# EAGLE schematic Quadrupedv2.0 (EAGLE 9.6.2)

## Sheet 1 of 2: Page 1
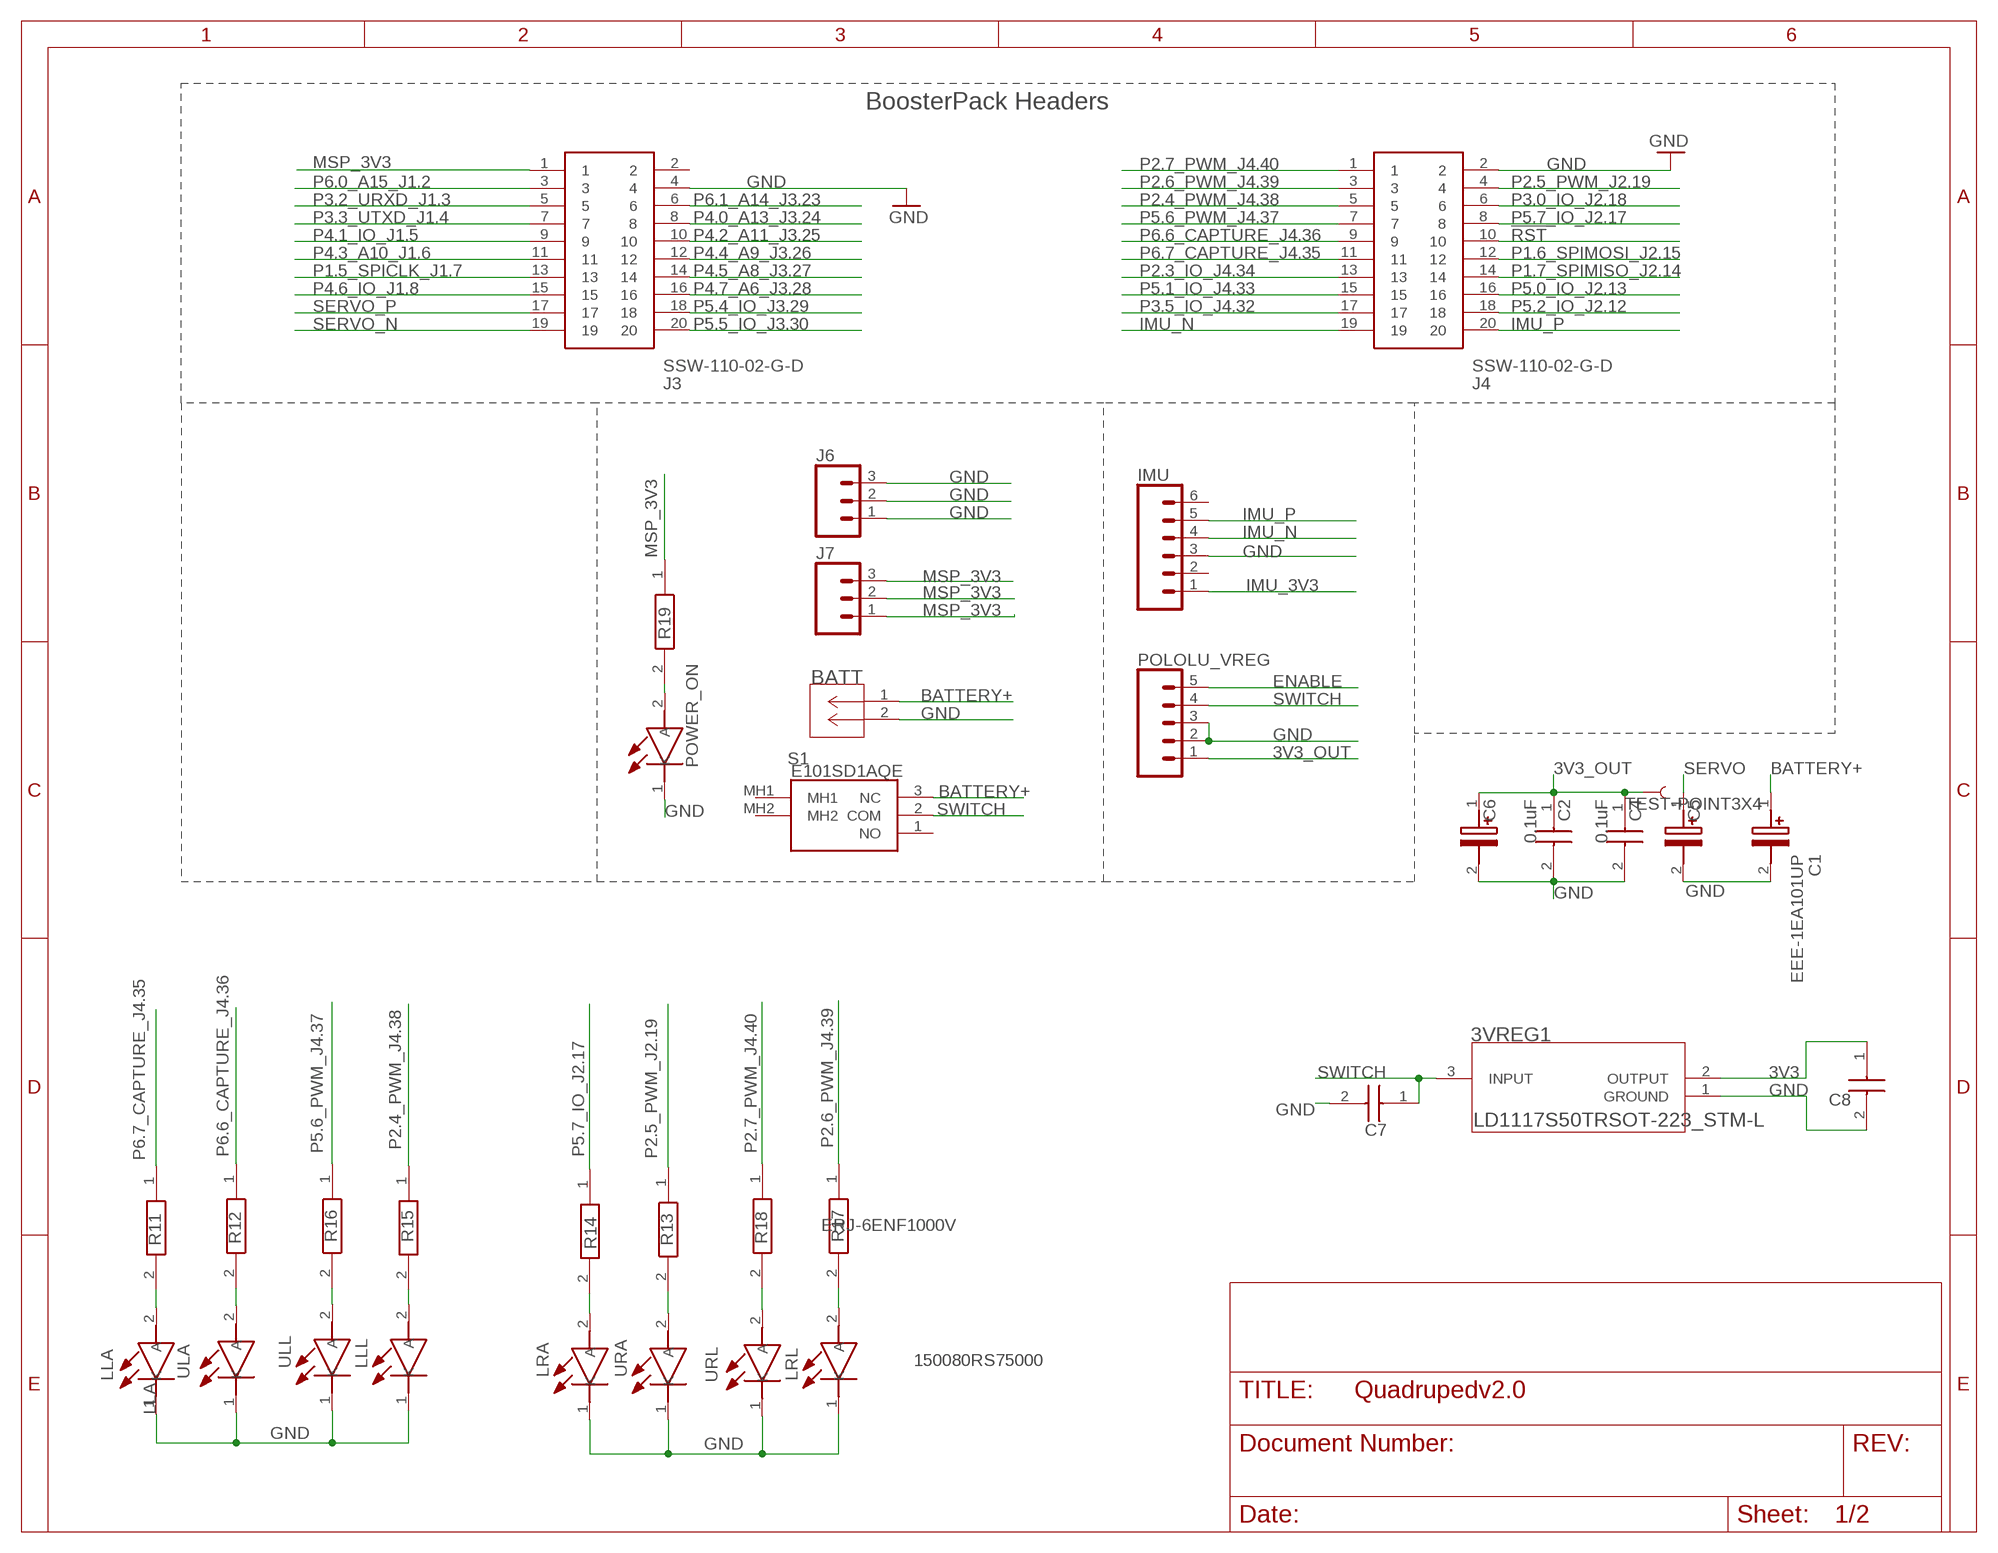
[diagram p0: schematic, sheet 1]

### Parts
3VREG1  LD1117S50TRSOT-223_STM-L  [SOT-223_STM-L]
BATT  640456-2  [CONN2_640456-2_TEC]
C1  EEE-1EA101UP  [CAPAE830X650N]
C2  0.1uF  C0805C104K5RAC7411  [CAPC2012X88N]
C4  0.1uF  C0805C104K5RAC7411  [CAPC2012X88N]
C5  EEE-1EA101UP  [CAPAE830X650N]
C6  EEE-1EA101UP  [CAPAE830X650N]
C7  C0805C104K5RAC7411  [CAPC2012X88N]
C8  C0805C104K5RAC7411  [CAPC2012X88N]
IMU  CONN_06SILK_FEMALE_PTH  [1X06]
J3  SSW-110-02-G-D  [SAMTEC_SSW-110-02-G]
J4  SSW-110-02-G-D  [SAMTEC_SSW-110-02-G]
J6  CONN_03CONN_3F  [1X03_FEMALE]
J7  CONN_03CONN_3F  [1X03_FEMALE]
LLA  150080RS75000  [LEDC2012X80N]
LLL  150080RS75000  [LEDC2012X80N]
LRA  150080RS75000  [LEDC2012X80N]
LRL  150080RS75000  [LEDC2012X80N]
POLOLU_VREG  CONN_05  [1X05]
POWER_ON  150080RS75000  [LEDC2012X80N]
R11  ERJ-6ENF1000V  [RESC2012X70N]
R12  ERJ-6ENF1000V  [RESC2012X70N]
R13  ERJ-6ENF1000V  [RESC2012X70N]
R14  ERJ-6ENF1000V  [RESC2012X70N]
R15  ERJ-6ENF1000V  [RESC2012X70N]
R16  ERJ-6ENF1000V  [RESC2012X70N]
R17  ERJ-6ENF1000V  [RESC2012X70N]
R18  ERJ-6ENF1000V  [RESC2012X70N]
R19  ERJ-6ENF1000V  [RESC2012X70N]
S1  E101SD1AQE  [E101SD1AQE]
TP22  TEST-POINT3X4  [PAD.03X.04]
ULA  150080RS75000  [LEDC2012X80N]
ULL  150080RS75000  [LEDC2012X80N]
URA  150080RS75000  [LEDC2012X80N]
URL  150080RS75000  [LEDC2012X80N]

### Nets
3V3 [LOWCurrent]: 3VREG1.2(OUTPUT) C8.1 ; also sheet 2
3V3_OUT: C2.1 C4.1 C6.1(+) POLOLU_VREG.1 TP22.P$1 ; also sheet 2
!RST: J4.10
BATTERY+: BATT.1 C1.1(+) S1.3(NC)
ENABLE: POLOLU_VREG.5
GND: 3VREG1.1(GROUND) BATT.2 C1.2(-) C2.2 C4.2 C5.2(-) C6.2(-) C7.2 C8.2 IMU.3 J3.4 J4.2 J6.1 J6.2 J6.3 LLA.1(K) LLL.1(K) LRA.1(K) LRL.1(K) POLOLU_VREG.2 POLOLU_VREG.3 POWER_ON.1(K) ULA.1(K) ULL.1(K) URA.1(K) URL.1(K) ; also sheet 2
IMU_3V3 [LOWCurrent]: IMU.1 ; also sheet 2
IMU_N [DIFF_I2C2]: IMU.4 J4.19
IMU_P [DIFF_I2C2]: IMU.5 J4.20
MSP_3V3 [LOWCurrent]: J3.1 J7.1 J7.2 J7.3 R19.1 ; also sheet 2
N$2: R12.2 ULA.2(A)
N$7: LLA.2(A) R11.2
N$8: R16.2 ULL.2(A)
N$11: LLL.2(A) R15.2
N$12: R13.2 URA.2(A)
N$13: LRA.2(A) R14.2
N$14: R18.2 URL.2(A)
N$15: LRL.2(A) R17.2
N$19: POWER_ON.2(A) R19.2
P1.5_SPICLK_J1.7: J3.13
P1.6_SPIMOSI_J2.15: J4.12
P1.7_SPIMISO_J2.14: J4.14
P2.3_IO_J4.34: J4.13
P2.4_PWM_J4.38: J4.5 R15.1
P2.5_PWM_J2.19: J4.4 R13.1
P2.6_PWM_J4.39: J4.3 R17.1
P2.7_PWM_J4.40: J4.1 R18.1
P3.0_IO_J2.18: J4.6
P3.2_URXD_J1.3: J3.5
P3.3_UTXD_J1.4: J3.7
P3.5_IO_J4.32: J4.17
P4.0_A13_J3.24: J3.8
P4.1_IO_J1.5: J3.9
P4.2_A11_J3.25: J3.10
P4.3_A10_J1.6: J3.11
P4.4_A9_J3.26: J3.12
P4.5_A8_J3.27: J3.14
P4.6_IO_J1.8: J3.15
P4.7_A6_J3.28: J3.16
P5.0_IO_J2.13: J4.16
P5.1_IO_J4.33: J4.15
P5.2_IO_J2.12: J4.18
P5.4_IO_J3.29: J3.18
P5.5_IO_J3.30: J3.20
P5.6_PWM_J4.37: J4.7 R16.1
P5.7_IO_J2.17: J4.8 R14.1
P6.0_A15_J1.2: J3.3
P6.1_A14_J3.23: J3.6
P6.6_CAPTURE_J4.36: J4.9 R12.1
P6.7_CAPTURE_J4.35: J4.11 R11.1
SERVO: C5.1(+) ; also sheet 2
SERVO_N [DIFF_I2C1]: J3.19 ; also sheet 2
SERVO_P [DIFF_I2C1]: J3.17 ; also sheet 2
SWITCH: 3VREG1.3(INPUT) C7.1 POLOLU_VREG.4 S1.2(COM)
Unconnected: IMU.2 IMU.6 J3.2 S1.1(NO) S1.MH1 S1.MH2

### Notes on the sheet
- BoosterPack Headers

## Sheet 2 of 2: Page 2
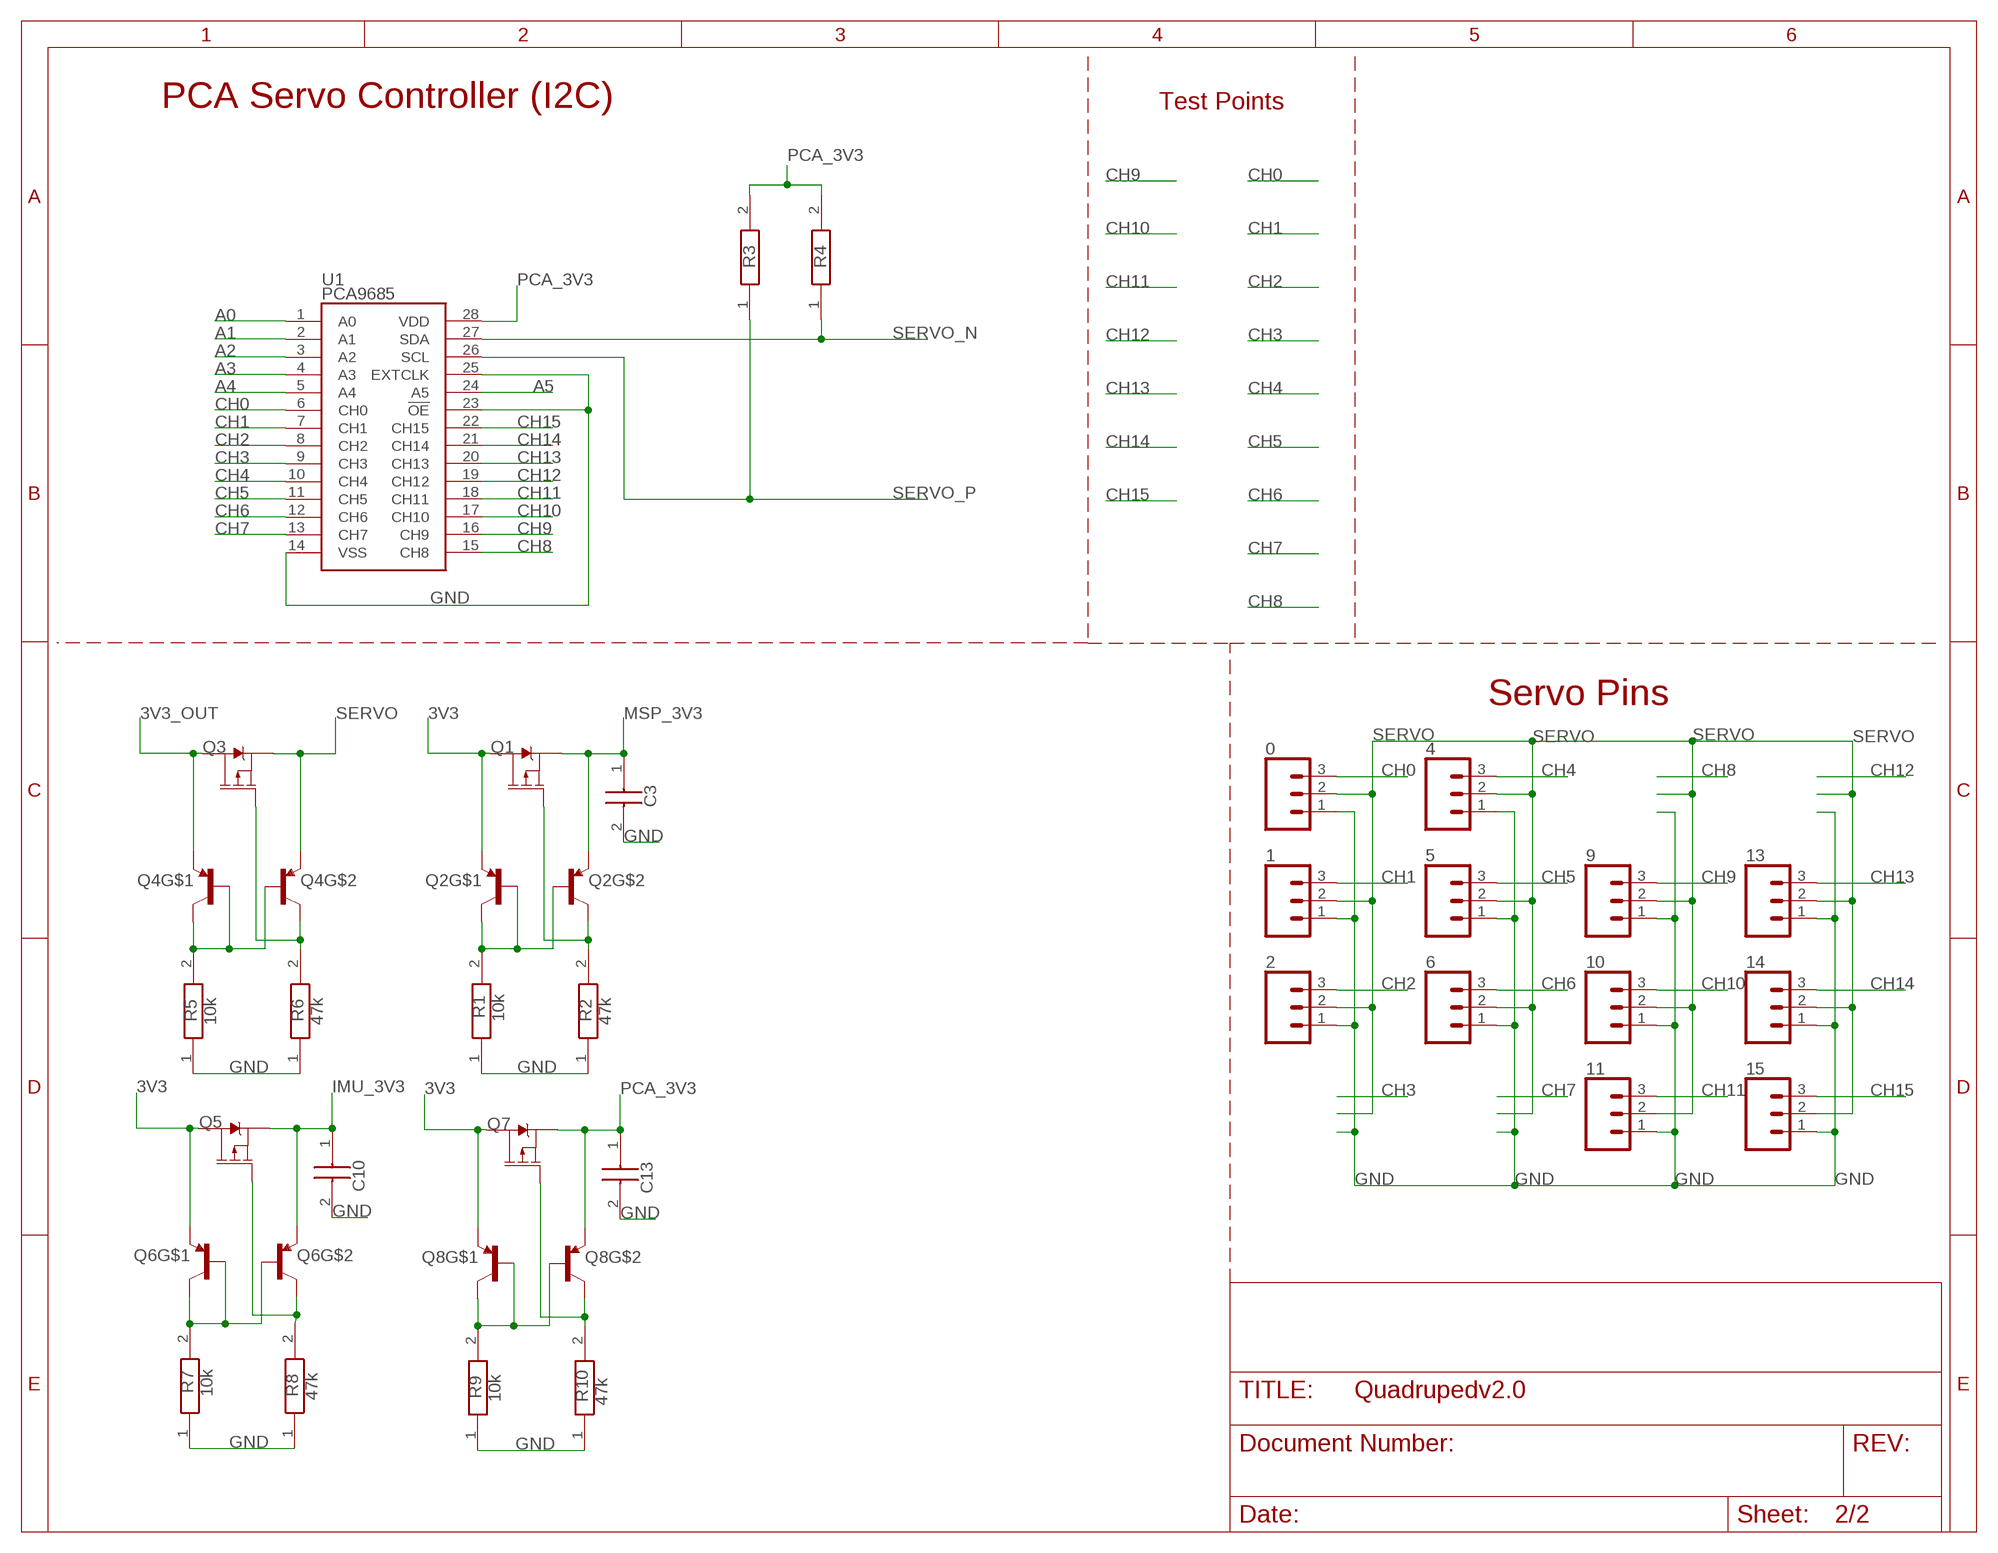
[diagram p1: schematic, sheet 2]

### Parts
0  CONN_03  [1X03MALE]
1  CONN_03  [1X03MALE]
2  CONN_03  [1X03MALE]
4  CONN_03  [1X03MALE]
5  CONN_03  [1X03MALE]
6  CONN_03  [1X03MALE]
9  CONN_03  [1X03MALE]
10  CONN_03  [1X03MALE]
11  CONN_03  [1X03MALE]
13  CONN_03  [1X03MALE]
14  CONN_03  [1X03MALE]
15  CONN_03  [1X03MALE]
C3  C0805C104K5RAC7411  [CAPC2012X88N]
C10  C0805C104K5RAC7411  [CAPC2012X88N]
C13  C0805C104K5RAC7411  [CAPC2012X88N]
Q1  2.5A/30V/105mΩ  MOSFET_PCH-DMG2307L  [SOT23-3]
Q2  TRANS_PNP_DUALSOT-363  [SOT363_PHILIPS]
Q3  2.5A/30V/105mΩ  MOSFET_PCH-DMG2307L  [SOT23-3]
Q4  TRANS_PNP_DUALSOT-363  [SOT363_PHILIPS]
Q5  2.5A/30V/105mΩ  MOSFET_PCH-DMG2307L  [SOT23-3]
Q6  TRANS_PNP_DUALSOT-363  [SOT363_PHILIPS]
Q7  2.5A/30V/105mΩ  MOSFET_PCH-DMG2307L  [SOT23-3]
Q8  TRANS_PNP_DUALSOT-363  [SOT363_PHILIPS]
R1  10k  ERJ-6ENF1000V  [RESC2012X70N]
R2  47k  ERJ-6ENF1000V  [RESC2012X70N]
R3  ERJ-6ENF1000V  [RESC2012X70N]
R4  ERJ-6ENF1000V  [RESC2012X70N]
R5  10k  ERJ-6ENF1000V  [RESC2012X70N]
R6  47k  ERJ-6ENF1000V  [RESC2012X70N]
R7  10k  ERJ-6ENF1000V  [RESC2012X70N]
R8  47k  ERJ-6ENF1000V  [RESC2012X70N]
R9  10k  ERJ-6ENF1000V  [RESC2012X70N]
R10  47k  ERJ-6ENF1000V  [RESC2012X70N]
U1  PCA9685  [TSSOP-28_4MM]

### Nets
3V3 [LOWCurrent]: Q1.3(D) Q2.1(E) Q5.3(D) Q6.1(E) Q7.3(D) Q8.1(E) ; also sheet 1
3V3_OUT: Q3.3(D) Q4.1(E) ; also sheet 1
A0: U1.1(A0)
A1: U1.2(A1)
A2: U1.3(A2)
A3: U1.4(A3)
A4: U1.5(A4)
A5: U1.24(A5)
CH0 [PWM]: 0.3 U1.6(CH0)
CH1 [PWM]: 1.3 U1.7(CH1)
CH2 [PWM]: 2.3 U1.8(CH2)
CH3 [PWM]: U1.9(CH3)
CH4 [PWM]: 4.3 U1.10(CH4)
CH5 [PWM]: 5.3 U1.11(CH5)
CH6 [PWM]: 6.3 U1.12(CH6)
CH7 [PWM]: U1.13(CH7)
CH8 [PWM]: U1.15(CH8)
CH9 [PWM]: 9.3 U1.16(CH9)
CH10 [PWM]: 10.3 U1.17(CH10)
CH11 [PWM]: 11.3 U1.18(CH11)
CH12 [PWM]: U1.19(CH12)
CH13 [PWM]: 13.3 U1.20(CH13)
CH14 [PWM]: 14.3 U1.21(CH14)
CH15 [PWM]: 15.3 U1.22(CH15)
GND: 0.1 1.1 2.1 4.1 5.1 6.1 9.1 10.1 11.1 13.1 14.1 15.1 C3.2 C10.2 C13.2 R1.1 R2.1 R5.1 R6.1 R7.1 R8.1 R9.1 R10.1 U1.14(VSS) U1.23(!OE) U1.25(EXTCLK) ; also sheet 1
IMU_3V3 [LOWCurrent]: C10.1 Q5.2(S) Q6.4(E) ; also sheet 1
MSP_3V3 [LOWCurrent]: C3.1 Q1.2(S) Q2.4(E) ; also sheet 1
N$3: Q7.1(G) Q8.3(C) R10.2
N$4: Q8.2(B) Q8.5(B) Q8.6(C) R9.2
N$5: Q1.1(G) Q2.3(C) R2.2
N$6: Q2.2(B) Q2.5(B) Q2.6(C) R1.2
N$9: Q5.1(G) Q6.3(C) R8.2
N$10: Q6.2(B) Q6.5(B) Q6.6(C) R7.2
N$16: Q4.2(B) Q4.5(B) Q4.6(C) R5.2
N$17: Q3.1(G) Q4.3(C) R6.2
PCA_3V3 [LOWCurrent]: C13.1 Q7.2(S) Q8.4(E) R3.2 R4.2 U1.28(VDD)
SERVO: 0.2 1.2 2.2 4.2 5.2 6.2 9.2 10.2 11.2 13.2 14.2 15.2 Q3.2(S) Q4.4(E) ; also sheet 1
SERVO_N [DIFF_I2C1]: R4.1 U1.27(SDA) ; also sheet 1
SERVO_P [DIFF_I2C1]: R3.1 U1.26(SCL) ; also sheet 1

### Notes on the sheet
- PCA Servo Controller (I2C) | Test Points
- Servo Pins

## Library data of the parts
0 1 2 4-6 9-11 13-15 J6 J7 = SparkFun-Connectors:CONN_03: Multi connection point. Often used as Generic Header-pin footprint for 0.1 inch spaced/style header connections On any of the 0.1 inch spaced packages, you can populate with these: Break Away Headers - Straight <https://www.sparkfun.com/products/116> (PRT-00116) Break Away Male Headers - Right Angle <https://www.sparkfun.com/products/553> (PRT-00553) Female Headers <https://www.sparkfun.com/products/115> (PRT-00115) Break Away Headers - Machine Pin <https://www.sparkfun.com/products/117> (PRT-00117) Break Away Female Headers - Swiss Machine Pin <https://www.sparkfun.com/products/743> (PRT-00743) Stackable Header - 3 Pin (Female, 0.1") <https://www.sparkfun.com/products/13875> (PRT-13875) For SCREWTERMINALS and SPRING TERMINALS visit here: Screw Terimnals on SparkFun.com <https://www.sparkfun.com/search/results?term=Screw+Terminals> (5mm/3.5mm/2.54mm spacing) This device is also useful as a general connection point to wire up your design to another part of your project. Our various solder wires solder well into these plated through hole pads. Hook-Up Wire - Assortment (Stranded, 22 AWG) <https://www.sparkfun.com/products/11375> (PRT-11375) Hook-Up Wire - Assortment (Solid Core, 22 AWG) <https://www.sparkfun.com/products/11367> (PRT-11367) View the entire wire category on our website here <https://www.sparkfun.com/categories/141> Special notes: Molex polarized connector foot print use with SKU : PRT-08232 with associated crimp pins and housings.
3VREG1 = LD1117S50TR:LD1117S50TR; BUILT_BY: EMA_UL_Team; MANUFACTURER_PART_NUMBER: LD1117S50TR; SOURCELIBRARY: StMicro_2011-06-07; VENDOR: STMicroelectronics
BATT = JST_POWER:640456-2; BUILT_BY: EMA_UL_Team; COPYRIGHT: Copyright (C) 2016 Accelerated Designs. All rights reserved; DESCRIPTION: 02P MTA100 HDR ASSY F/L SQ STR; MANUFACTURER_PART_NUMBER: 640456-2; PITCH_MM_: 2.54; POSITIONS: 2; PRODUCT: Connector; ROWS-CONFIG: 1; SOURCELIBRARY: TE_Connectivity-2018-03-16; TE_PART_NUMBER: 640456-2; TYPE: Header; VENDOR: TE Connectivity
C1 C5 C6 = EEE-1EA101UP:EEE-1EA101UP: Cap Aluminum Lytic 100uF 25V 20% (8 X 6.2mm) SMD 91mA 2000h 85C Automotive T/R Source: Datasheet <https://componentsearchengine.com/Datasheets/1/EEE-1EA101UP.pdf>; DESCRIPTION: Cap Aluminum Lytic 100uF 25V 20% (8 X 6.2mm) SMD 91mA 2000h 85C Automotive T/R; HEIGHT: 6.5mm; MANUFACTURER_NAME: Panasonic; MANUFACTURER_PART_NUMBER: EEE-1EA101UP; MOUSER_PART_NUMBER: 667-EEE-1EA101UP; MOUSER_PRICE-STOCK: https://www.mouser.com/Search/Refine.aspx?Keyword=667-EEE-1EA101UP
C2-C4 C7 C8 C10 C13 = C0805C104K5RAC7411:C0805C104K5RAC7411: Cap Ceramic 0.1uF 50V X7R 10% Pad SMD 0805 125C T/R Source: Datasheet; DESCRIPTION: Cap Ceramic 0.1uF 50V X7R 10% Pad SMD 0805 125C T/R; HEIGHT: 0.88mm; MANUFACTURER_NAME: Kemet; MANUFACTURER_PART_NUMBER: C0805C104K5RAC7411; MOUSER_PART_NUMBER: 80-C0805C104K5RACLR; MOUSER_PRICE-STOCK: https://www.mouser.co.uk/ProductDetail/KEMET/C0805C104K5RAC7411?qs=jbRM9o5BbzPcVXF0wW9AYg%3D%3D
IMU = SparkFun-Connectors:CONN_06: Multi connection point. Often used as Generic Header-pin footprint for 0.1 inch spaced/style header connections On any of the 0.1 inch spaced packages, you can populate with these: Break Away Headers - Straight <https://www.sparkfun.com/products/116> (PRT-00116) Break Away Male Headers - Right Angle <https://www.sparkfun.com/products/553> (PRT-00553) Female Headers <https://www.sparkfun.com/products/115> (PRT-00115) Break Away Headers - Machine Pin <https://www.sparkfun.com/products/117> (PRT-00117) Break Away Female Headers - Swiss Machine Pin <https://www.sparkfun.com/products/743> (PRT-00743) Arduino Stackable Header - 6 Pin <https://www.sparkfun.com/products/9280> (PRT-09280) For SCREWTERMINALS and SPRING TERMINALS visit here: Screw Terimnals on SparkFun.com <https://www.sparkfun.com/search/results?term=Screw+Terminals> (5mm/3.5mm/2.54mm spacing) This device is also useful as a general connection point to wire up your design to another part of your project. Our various solder wires solder well into these plated through hole pads. Hook-Up Wire - Assortment (Stranded, 22 AWG) <https://www.sparkfun.com/products/11375> (PRT-11375) Hook-Up Wire - Assortment (Solid Core, 22 AWG) <https://www.sparkfun.com/products/11367> (PRT-11367) View the entire wire category on our website here <https://www.sparkfun.com/categories/141>; PROD_ID: CONN-08437
J3 J4 = SSW-110-02-G-D:SSW-110-02-G-D: 20 Position, .100" Tiger Buy™ Socket Strip Source: Datasheet <http://suddendocs.samtec.com/prints/ssw-1xx-xx-xxx-x-xx-xxx-xx-mkt.pdf>; DESCRIPTION: 20 Position, .100&quot; Tiger Buy&trade; Socket Strip; HEIGHT: mm; MANUFACTURER_NAME: SAMTEC; MANUFACTURER_PART_NUMBER: SSW-110-02-G-D; MOUSER_PART_NUMBER: 200-SSW11002GD; MOUSER_PRICE-STOCK: https://www.mouser.co.uk/ProductDetail/Samtec/SSW-110-02-G-D?qs=iT52DjcXudsm22Pawb3w1g%3D%3D
LLA LLL LRA LRL POWER_ON ULA ULL URA URL = 150080RS75000:150080RS75000: LED,Wurth Elektronik,150080RS75000 Wurth Elektronik 150080RS75000, WL-SMCW Series Red LED, 625 nm 2012 (0805) Clear, Rectangle Lens SMD package Source: Datasheet <https://componentsearchengine.com/Datasheets/2/150080RS75000.pdf>; DESCRIPTION: LED,Wurth Elektronik,150080RS75000 Wurth Elektronik 150080RS75000, WL-SMCW Series Red LED, 625 nm 2012 (0805) Clear, Rectangle Lens SMD package; HEIGHT: 0.8mm; MANUFACTURER_NAME: Wurth Elektronik; MANUFACTURER_PART_NUMBER: 150080RS75000; MOUSER_PART_NUMBER: 710-150080RS75000; MOUSER_PRICE-STOCK: https://www.mouser.co.uk/ProductDetail/Wurth-Elektronik/150080RS75000?qs=LlUlMxKIyB2jdCo7bnfgew%3D%3D
POLOLU_VREG = SparkFun-Connectors:CONN_05: Multi connection point. Often used as Generic Header-pin footprint for 0.1 inch spaced/style header connections On any of the 0.1 inch spaced packages, you can populate with these: Break Away Headers - Straight <https://www.sparkfun.com/products/116> (PRT-00116) Break Away Male Headers - Right Angle <https://www.sparkfun.com/products/553> (PRT-00553) Female Headers <https://www.sparkfun.com/products/115> (PRT-00115) Break Away Headers - Machine Pin <https://www.sparkfun.com/products/117> (PRT-00117) Break Away Female Headers - Swiss Machine Pin <https://www.sparkfun.com/products/743> (PRT-00743) For SCREWTERMINALS and SPRING TERMINALS visit here: Screw Terimnals on SparkFun.com <https://www.sparkfun.com/search/results?term=Screw+Terminals> (5mm/3.5mm/2.54mm spacing) This device is also useful as a general connection point to wire up your design to another part of your project. Our various solder wires solder well into these plated through hole pads. Hook-Up Wire - Assortment (Stranded, 22 AWG) <https://www.sparkfun.com/products/11375> (PRT-11375) Hook-Up Wire - Assortment (Solid Core, 22 AWG) <https://www.sparkfun.com/products/11367> (PRT-11367) View the entire wire category on our website here <https://www.sparkfun.com/categories/141> Special notes: Molex polarized connector foot print use with SKU : PRT-08231 with associated crimp pins and housings. 1MM SMD Version SKU: PRT-10208
Q1 Q3 Q5 Q7 = SparkFun-DiscreteSemi:MOSFET_PCH: P-channel MOSFETs Voltage controlled devices that allow control of high current outputs. SparkFun Products: SparkFun ESP32 Thing <https://www.sparkfun.com/products/13907> SparkFun ESP8266 Thing <https://www.sparkfun.com/products/13231>; PROD_ID: TRANS-11308
Q2 Q4 Q6 Q8 = SparkFun-DiscreteSemi:TRANS_PNP_DUAL: Dual PNP Transistors in Single Package The BCM857BS puts two PNP transistors in a single package. Bipolar (BJT) Transistor Array 2 PNP (Dual) 45V 100mA 100MHz 200mW Surface Mount SOT-363 Datasheet <https://www.diodes.com/assets/Datasheets/BCM857BS.pdf> SparkFun Products: SparkFun Pi Servo HAT V2 <https://www.sparkfun.com>; PROD_ID: TRAN-14386
R1-R19 = ERJ-6ENF1000V:ERJ-6ENF1000V: RESISTOR, 0805 100 OHM +/- 1 % 0.125 W Source: Datasheet <https://industrial.panasonic.com/cdbs/www-data/pdf/RDA0000/AOA0000C84.pdf>; DESCRIPTION: RESISTOR, 0805 100 OHM +/- 1 % 0.125 W; HEIGHT: 0.7mm; MANUFACTURER_NAME: Panasonic; MANUFACTURER_PART_NUMBER: ERJ-6ENF1000V; MOUSER_PART_NUMBER: 667-ERJ-6ENF1000V; MOUSER_PRICE-STOCK: https://www.mouser.co.uk/ProductDetail/Panasonic/ERJ-6ENF1000V?qs=4WZYzuGhm5opkpyunBjW%2FA%3D%3D
S1 = E101SD1AQE:E101SD1AQE: Toggle Switches ON None ON SPDT 7.5A 250VAC 28VDC Source: Datasheet <https://componentsearchengine.com/Datasheets/1/E101SD1AQE.pdf>; DESCRIPTION: Toggle Switches ON None ON SPDT 7.5A 250VAC 28VDC; HEIGHT: 6.6mm; MANUFACTURER_NAME: C & K COMPONENTS; MANUFACTURER_PART_NUMBER: E101SD1AQE; MOUSER_PART_NUMBER: 611-E101SD1AQE; MOUSER_PRICE-STOCK: https://www.mouser.com/Search/Refine.aspx?Keyword=611-E101SD1AQE
TP22 = SparkFun-Connectors:TEST-POINT: SparkFun Test Points Bare copper test points for troubleshooting or In-Circuit-Testing. These are used by our Production team for verifying production board runs using pogo-pins on test beds. SparkFun Products: SparkFun LSM9DS1 Breakout <https://www.sparkfun.com/products/13284> SparkFun PSOC <https://www.sparkfun.com/products/13714> SparkFun Load Cell Amplifier <https://www.sparkfun.com/products/13879>
U1 = SparkFun-IC-Special-Function:PCA9685: 16-channel 12-bit PWM I2C interface Internal Oscillator 40Hz to 1kHz Can be totem pole or open collector 2.3V to 5.5V SparkFun Products SparkFun Block for Intel® Edison - PWM <https://www.sparkfun.com/products/13042> (DEV-13042) PROTO: IC-12240 PROD_ID: IC-12271; PROD_ID: IC-12271

## Net classes
0 default: width 0.203 mm, drill 0.381 mm, clearance 0.254 mm
1 DIFF_I2C1: width 0.406 mm, drill 0.381 mm, clearance 0.254 mm
2 SERVOS: width 0.508 mm, drill 0.381 mm, clearance 0.254 mm
3 DIFF_I2C2: width 0.406 mm, drill 0.381 mm, clearance 0.254 mm
4 LOWCurrent: width 0.406 mm, drill 0.381 mm, clearance 0.254 mm
5 PWM: width 0.305 mm, drill 0.381 mm, clearance 0.254 mm